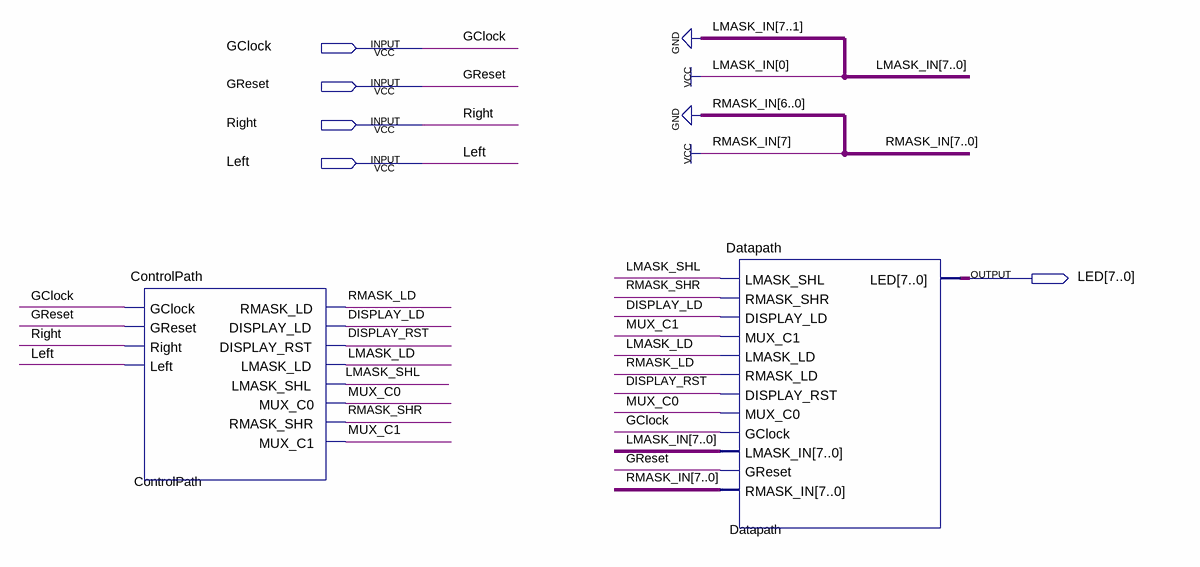
[diagram p0: schematic sheet]
// Quartus schematic Project.bdf as structural Verilog: 2 symbols, 5 pins
module Project (
  input  GClock,
  input  GReset,
  input  Right,
  input  Left,
  output [7:0] LED
);

  wire DISPLAY_LD, DISPLAY_RST, LMASK_LD, LMASK_SHL, MUX_C0, MUX_C1, RMASK_LD, RMASK_SHR;

  ControlPath ControlPath (
    .GClock(GClock), .GReset(GReset), .Right(Right), .Left(Left), .RMASK_LD(RMASK_LD),
    .DISPLAY_LD(DISPLAY_LD), .DISPLAY_RST(DISPLAY_RST), .LMASK_LD(LMASK_LD), .LMASK_SHL(LMASK_SHL),
    .MUX_C0(MUX_C0), .RMASK_SHR(RMASK_SHR), .MUX_C1(MUX_C1));
  Datapath Datapath (
    .LMASK_SHL(LMASK_SHL), .RMASK_SHR(RMASK_SHR), .DISPLAY_LD(DISPLAY_LD), .MUX_C1(MUX_C1),
    .LMASK_LD(LMASK_LD), .RMASK_LD(RMASK_LD), .DISPLAY_RST(DISPLAY_RST), .MUX_C0(MUX_C0), .GClock(GClock),
    .LMASK_IN(8'b00000001), .GReset(GReset), .RMASK_IN(8'b10000000), .LED(LED));
endmodule
